# EAGLE design BpodTeensyShield (EAGLE 7.7.0)
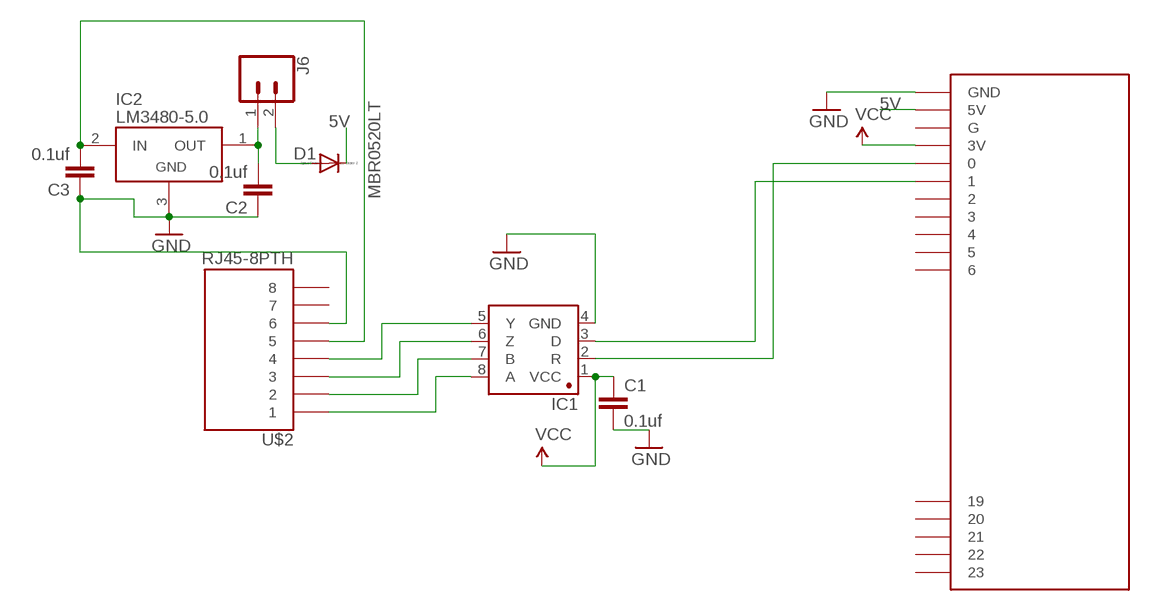
[diagram p0: schematic, sheet 1]

## Parts
C1  0.1uf  CAP1206  [1206@1]
C2  0.1uf  CAP1206  [1206@1]
C3  0.1uf  CAP1206  [1206@1]
D1  MBR0520LT  [SOD123]
IC1  SN65HVD31DR  [SO08]
IC2  LM3480-5.0  [SOT-23-3]
J6  CONN_02  [1X02]
U$1  AUDIOSHIELD  [AUDIOSHIELD]
U$2  RJ45-8PTH  [RJ45-8]

## Nets
5V: D1.C U$1.5V
GND: C1.2 C2.1 C3.1 IC1.4(GND) IC2.3(GND) U$1.GND U$2.6
N$7: IC1.8(A) U$2.1
N$8: IC1.7(B) U$2.2
N$9: IC1.6(Z) U$2.3
N$10: IC1.5(Y) U$2.4
N$14: C2.2 IC2.1(OUT) J6.1
N$18: D1.A J6.2
N$24: C3.2 IC2.2(IN) U$2.5
RX1: IC1.2(R) U$1.0
TX1: IC1.3(D) U$1.1
VCC: C1.1 IC1.1(VCC) U$1.3V
Unconnected: U$1.2 U$1.3 U$1.4 U$1.5 U$1.6 U$1.19 U$1.20 U$1.21 U$1.22 U$1.23 U$1.G U$2.7 U$2.8

## Notes on the sheet
- 5V
- 5V

## Library data of the parts
C1-C3 = SparkFun-Capacitors:CAP: Capacitor Standard 0603 ceramic capacitor, and 0.1" leaded capacitor.
D1 = diode:MBR0520LT: SCHOTTKY BARRIER RECTIFIER Source: http://onsemi.com .. MBR0520LT1-D.pdf
IC1 = Joshparts4:SN65HVD31DR: A placeholder for generic narrow & wide SOIC8 foorptints - used on the DIP adapter board.
IC2 = regulators:LM3480-*: National Semiconductor LM3480 100 mA, SOT-23, quasi-LDO linear regulator
J6 = SparkFun-Connectors:CONN_02: Multi connection point. Often used as Generic Header-pin footprint for 0.1 inch spaced/style header connections On any of the 0.1 inch spaced packages, you can populate with these: Break Away Headers - Straight <https://www.sparkfun.com/products/116> (PRT-00116) Break Away Male Headers - Right Angle <https://www.sparkfun.com/products/553> (PRT-00553) Female Headers <https://www.sparkfun.com/products/115> (PRT-00115) Break Away Headers - Machine Pin <https://www.sparkfun.com/products/117> (PRT-00117) Break Away Female Headers - Swiss Machine Pin <https://www.sparkfun.com/products/743> (PRT-00743) For SCREWTERMINALS and SPRING TERMINALS visit here: Screw Terimnals on SparkFun.com <https://www.sparkfun.com/search/results?term=Screw+Terminals> (5mm/3.5mm/2.54mm spacing) This device is also useful as a general connection point to wire up your design to another part of your project. Our various solder wires solder well into these plated through hole pads. Hook-Up Wire - Assortment (Stranded, 22 AWG) <https://www.sparkfun.com/products/11375> (PRT-11375) Hook-Up Wire - Assortment (Solid Core, 22 AWG) <https://www.sparkfun.com/products/11367> (PRT-11367) View the entire wire category on our website here <https://www.sparkfun.com/categories/141> Special notes: Molex polarized connector foot print use with: PRT-08233 with associated crimp pins and housings. 2.54_SCREWTERM for use with PRT-10571. 3.5mm Screw Terminal footprints for PRT-08084 5mm Screw Terminal footprints for use with PRT-08432
U$1 = Teensy_Audioshield:AUDIOSHIELD: Teensy 3 Audioshield by PJRC.COM
U$2 = SparkFun:RJ45-8: RJ45 Jack Simple RJ45, 8-pin connection - connector for common Cat5, Cat5e, and Cat6 Ethernet cables. Footprint not yet proven in production. Connector sku is PRT-00643; Breakout PCB sku is BOB-00716.

## Board
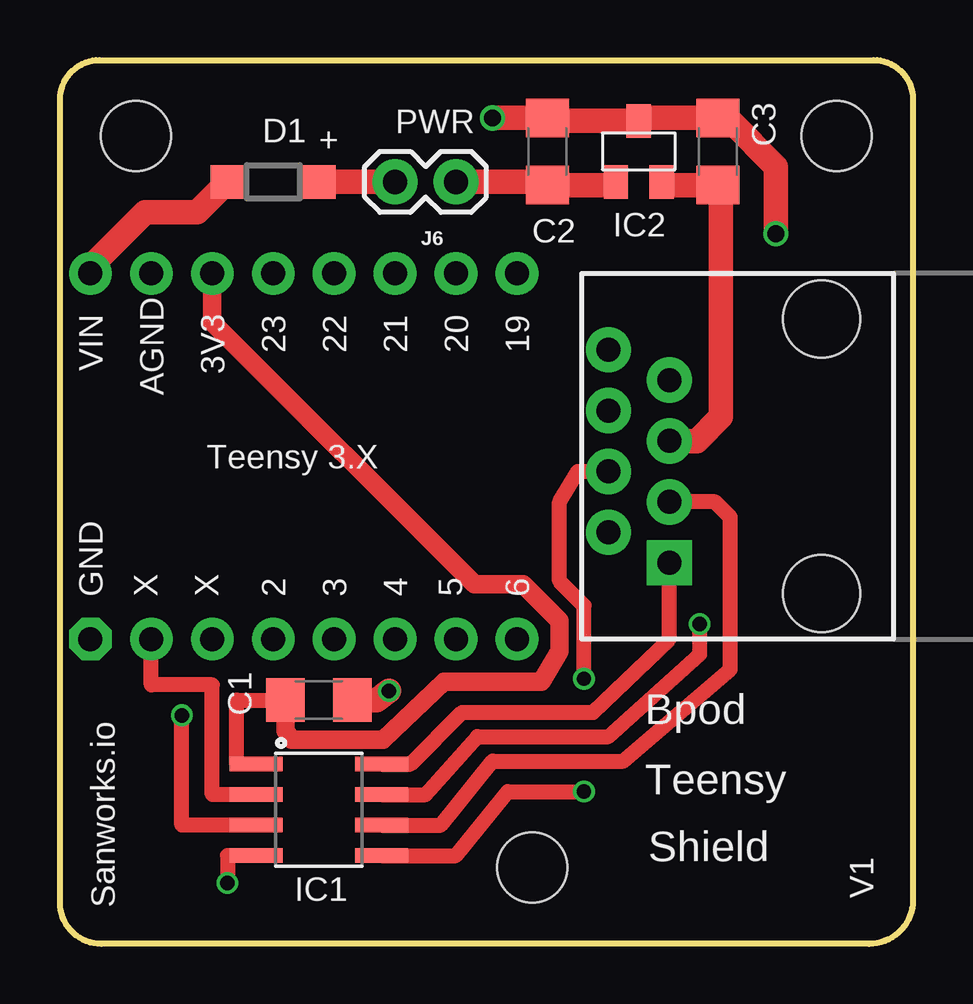
[diagram p1: board, top side]
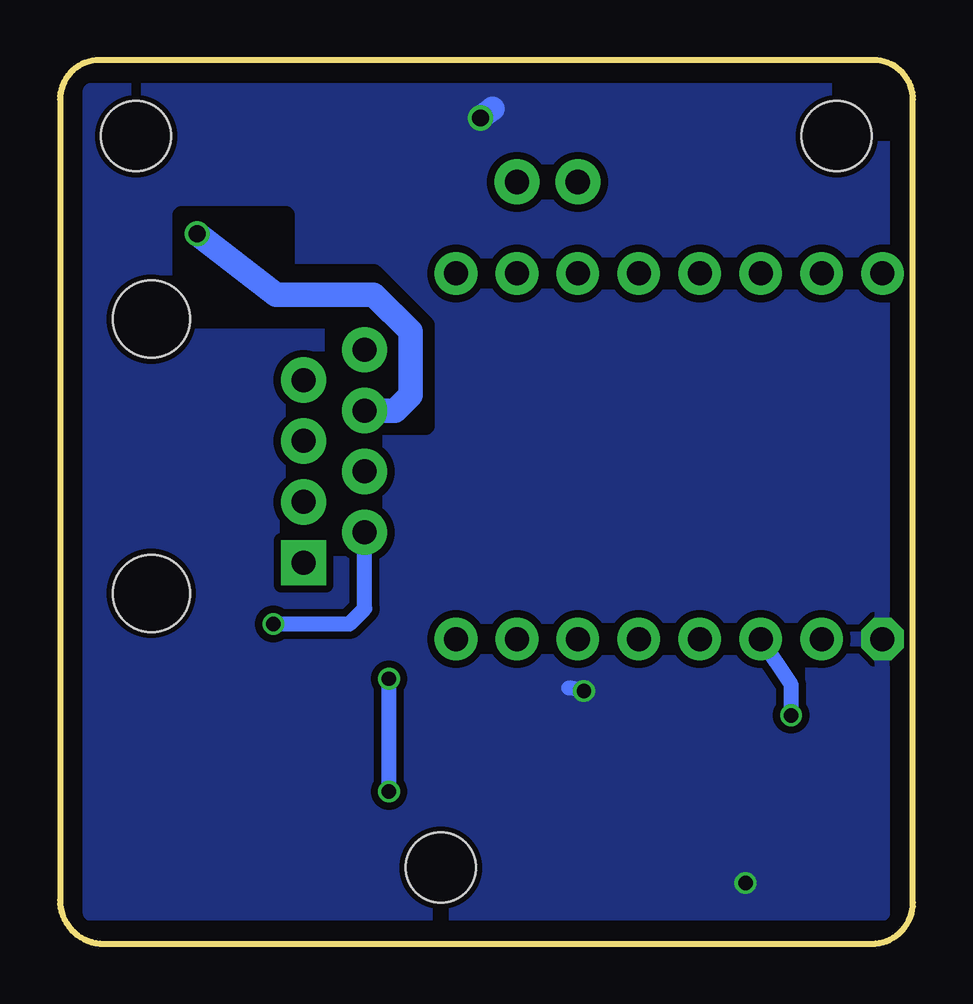
[diagram p2: board, bottom side, seen from below]

Size 35.56 x 36.83 mm. Coordinates in mm from the lower left corner, seen from the top.
Outline: 33.73,0 1.73,0 arc-90 0,1.73 0,35.17 arc-90 1.66,36.83 33.91,36.83 arc-90 35.56,35.18 35.56,1.83 arc-90 33.73,0
Copper layers (1*16): Top 0.035mm / dielectric 1.5mm / Bottom 0.035mm
Design rules "SeeedStudio_2layer_DRU_no_angle_20140221 *": minimum track width 6mil, minimum drill 12mil, track to track 12mil, track to pad 12mil, pad to pad 12mil, via to via 12mil, smd to smd 0mil, copper to edge 10mil, drill to drill 10mil, minimum pad ring 10mil, minimum via ring 6mil, stop-mask expansion 2mil, vias tented up to drill 100mil, thermal gap 10mil
bRestrict: area 20.3,21.6 to 30.5,30.4

### Footprints (pad centres in the part's own frame; a part is rotated, then mirrored left to right if it is on the bottom)
1206@1 = smd 1.6 x 1.8: 1 -1.4,0; 2 1.4,0
SOD123 = smd 1.4 x 1.4: A 1.9,0; C -1.9,0
SO08 = smd 0.61 x 2.21: 1 -1.905,-2.616; 2 -0.635,-2.616; 3 0.635,-2.616; 4 1.905,-2.616; 5 1.905,2.616; 6 0.635,2.616; 7 -0.635,2.616; 8 -1.905,2.616
SOT-23-3 = smd 1.016 x 1.397: 1 -0.953,-1.27; 2 0.953,-1.27; 3 0,1.27
1X02 = drill 1.016 pad 1.88: 1 0,0; 2 2.54,0
AUDIOSHIELD = drill 1 pad 1.778: 0 -13.97,-5.08; 1 -11.43,-5.08; 2 -8.89,-5.08; 3 -6.35,-5.08; 3V -11.43,10.16; 4 -3.81,-5.08; 5 -1.27,-5.08; 5V -16.51,10.16; 6 1.27,-5.08; 19 1.27,10.16; 20 -1.27,10.16; 21 -3.81,10.16; 22 -6.35,10.16; 23 -8.89,10.16; G -13.97,10.16 | drill 1 pad 1.778 octagon: GND -16.51,-5.08 | hole 2.921: 1.905,-14.605; -14.605,15.875; 14.605,15.875
RJ45-8 = drill 1 pad 1.88 square: 1 -4.445,6.35 | drill 1 pad 1.88: 2 -3.175,8.89; 3 -1.905,6.35; 4 -0.635,8.89; 5 0.635,6.35; 6 1.905,8.89; 7 3.175,6.35; 8 4.445,8.89 | hole 3.2: -5.715,0; 5.715,0

### Placement (x,y rotation side)
C1  10.79,10.16 0 top
C2  20.32,33.02 270 top
C3  27.43,33.02 270 top
D1  8.89,31.75 0 top
IC1  10.79,5.59 270 top
IC2  24.13,33.02 0 top
J6  16.51,31.75 180 top
U$1  17.78,17.78 0 top
U$2  31.75,20.32 90 top

### Tracks (layer width: path | path; a pad name or v marks a point on that pad's centre or on a via)
5V
  Top 1.016: U$1.5V 1.27,28.19 3.56,30.48 5.72,30.48 D1.C
GND  (via drill 0.6, 0.7)
  Top 0.635: IC1.4 6.99,3.68 v6.99,2.54
  Top 1.016: v18.03,34.42 18.16,34.42 C2.1 20.45,34.29 IC2.3 24.26,34.42 C3.1 27.56,34.29 27.94,34.29 29.84,32.38 v29.84,29.59 | C1.2 13.21,10.16 v13.72,10.54
  Bottom 0.635: v13.72,10.54 14.35,10.67
  Bottom 1.016: v18.03,34.42 17.53,34.8 | U$2.6 21.59,22.23 20.95,22.86 20.95,25.53 22.48,27.05 26.54,27.05 v29.84,29.59
  pour Bottom: 1.27,35.56 1.27,1.27 34.29,1.27 34.29,35.56
N$7
  Top 0.635: IC1.8 14.61,7.49 16.76,9.65 22.23,9.65 25.4,12.7 U$2.1
N$8  (via drill 0.6)
  Top 0.635: IC1.7 15.24,6.22 17.4,8.64 22.86,8.64 26.67,12.06 v26.67,13.34
  Bottom 0.635: v26.67,13.34 23.5,13.34 22.86,13.97 U$2.2
N$9
  Top 0.635: IC1.6 15.88,4.95 18.03,7.62 23.5,7.62 27.94,11.43 27.94,17.78 27.3,18.41 U$2.3
N$10  (via drill 0.6)
  Top 0.635: IC1.5 16.51,3.68 18.67,6.35 v21.84,6.35 | U$2.4 21.59,19.68 20.83,18.41 20.83,15.11 21.84,14.1 v21.84,11.05
  Bottom 0.635: v21.84,6.35 v21.84,11.05
N$14
  Top 1.016: J6.1 20.19,31.75 C2.2 23.05,31.62 IC2.1
N$18
  Top 1.016: D1.A J6.2
N$24
  Top 1.016: U$2.5 26.54,20.95 27.56,21.97 27.56,31.49 C3.2 25.21,31.62 IC2.2
RX1
  Top 0.635: IC1.2 6.35,6.22 6.35,10.79 3.81,10.79 U$1.0
TX1  (via drill 0.6)
  Top 0.635: IC1.3 5.08,4.95 v5.08,9.53
  Bottom 0.635: v5.08,9.53 5.08,10.79 U$1.1
VCC
  Top 0.635: IC1.1 7.37,7.49 7.37,10.16 C1.1
  Top 0.762: U$1.3V 6.35,25.91 17.27,14.99 19.3,14.99 20.83,13.46 20.83,12.19 20.07,10.92 16,10.92 13.46,8.51 9.65,8.51 9.4,8.89 C1.1

### Text on the board
tPlace: PWR | + | 23 | 22 | 21 | 20 | 19 | VIN | 3V3 | AGND | Teensy 3.X | GND | X | X | 2 | 3 | 4 | 5 | 6 | Bpod | Teensy | Shield | Sanworks.io | V1